# EAGLE design Meeblip V 2.04 Micro (EAGLE 5.11)
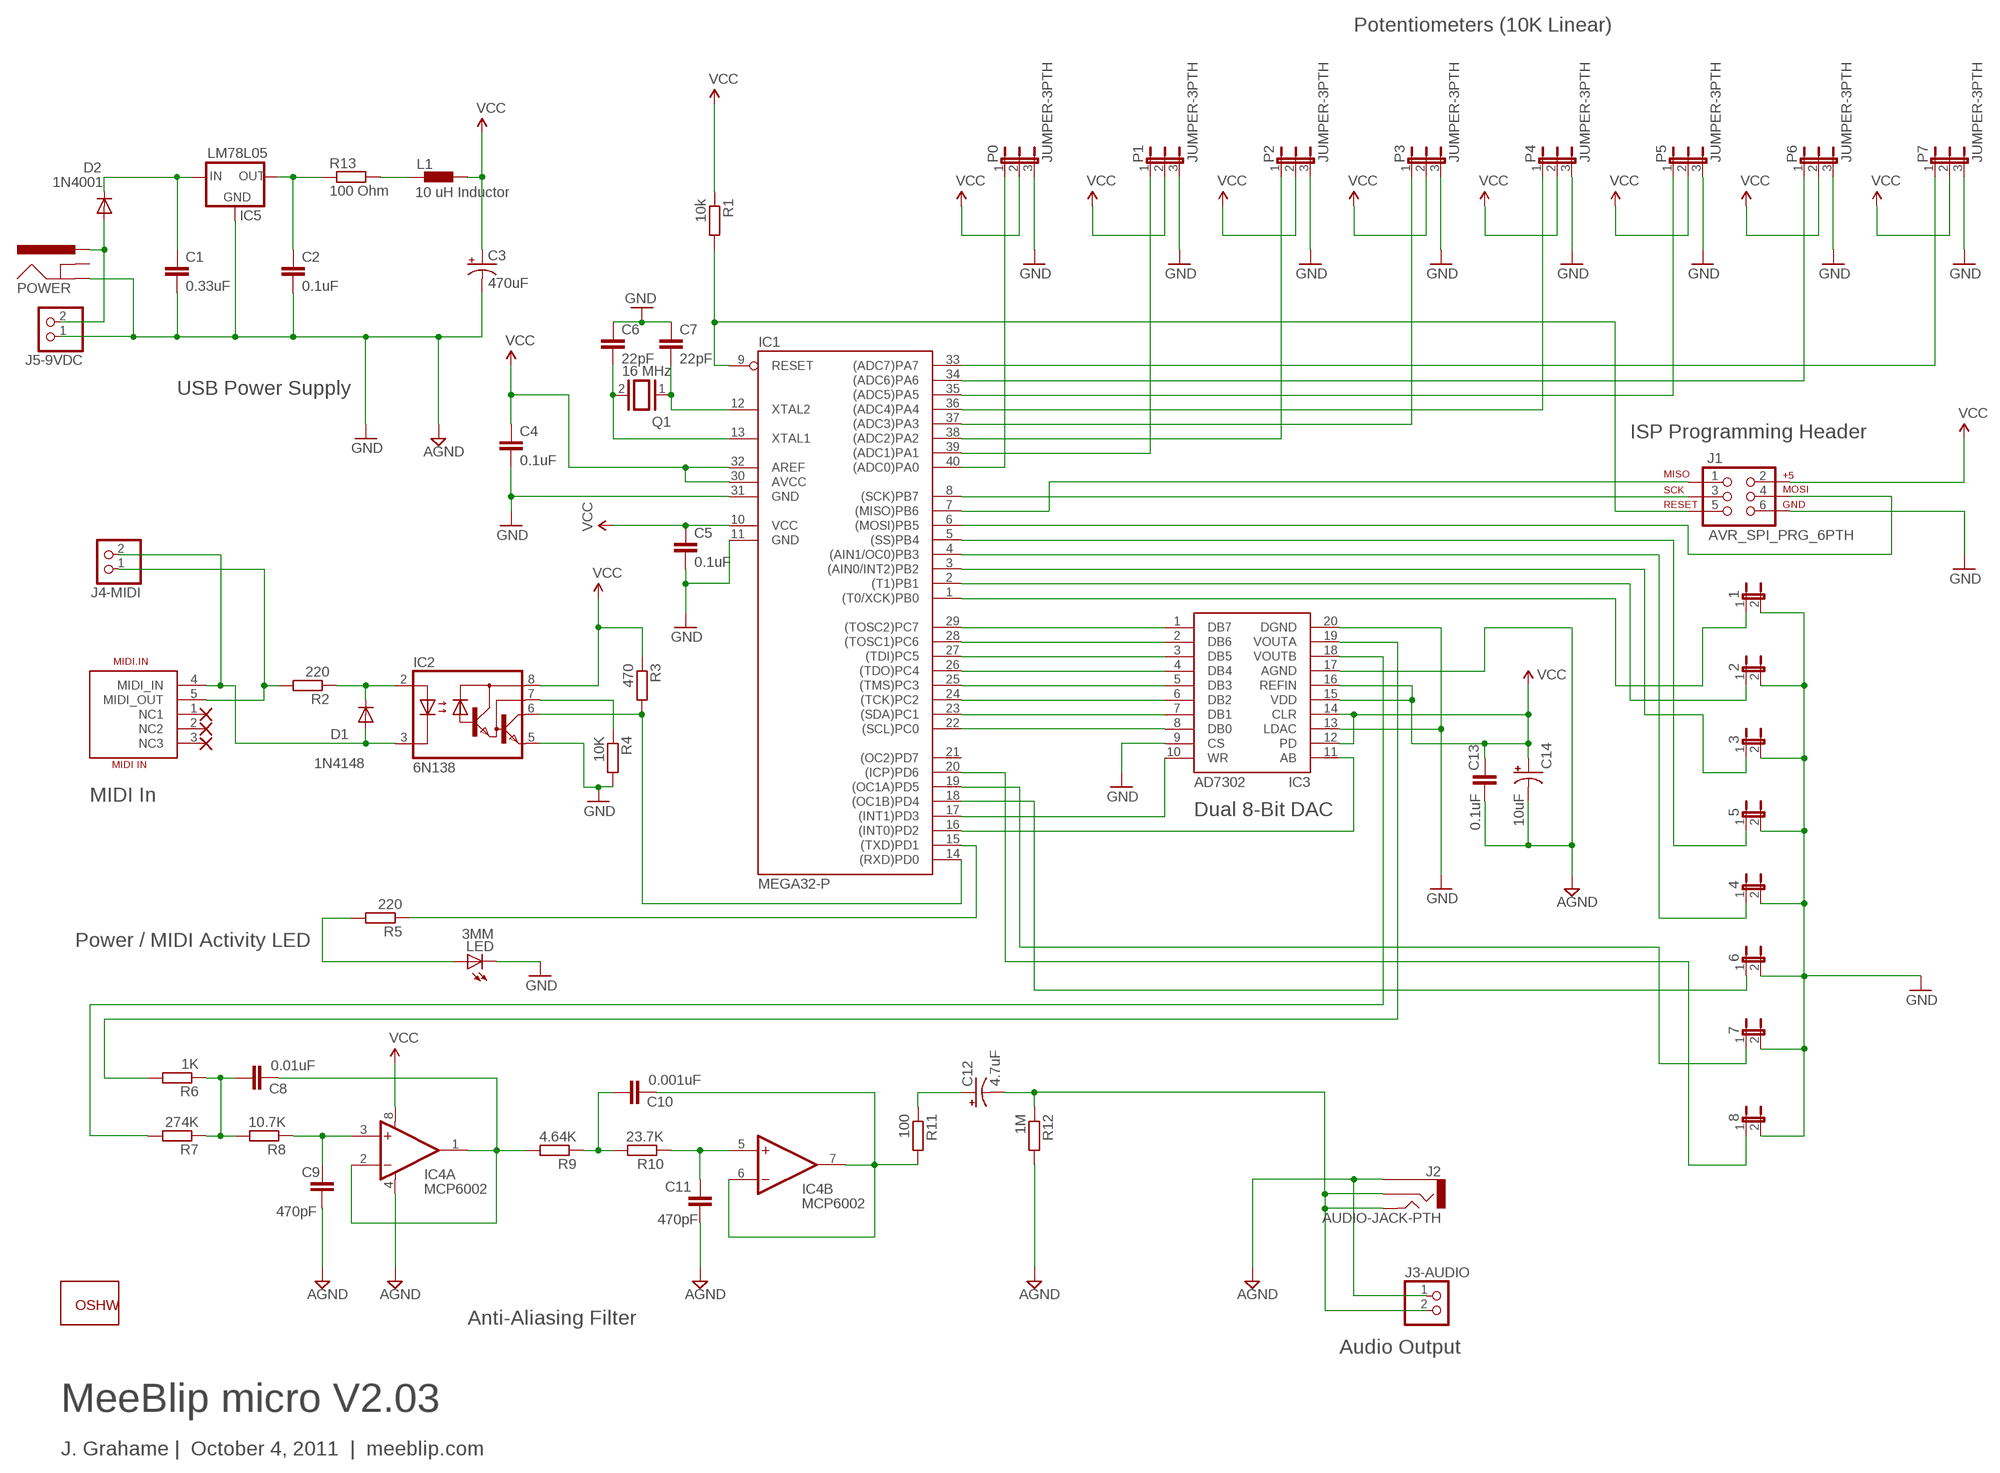
[diagram p0: schematic, sheet 1]

## Parts
1  JUMPER-2PTH  [1X02]
2  JUMPER-2PTH  [1X02]
3  JUMPER-2PTH  [1X02]
4  JUMPER-2PTH  [1X02]
5  JUMPER-2PTH  [1X02]
6  JUMPER-2PTH  [1X02]
7  JUMPER-2PTH  [1X02]
8  JUMPER-2PTH  [1X02]
C1  0.33uF  CAPPTH  [CAP-PTH-SMALL]
C2  0.1uF  CAPPTH  [CAP-PTH-SMALL]
C3  470uF  CAP_POLPTH2  [CPOL-RADIAL-10UF-25V]
C4  0.1uF  CAPPTH  [CAP-PTH-SMALL]
C5  0.1uF  CAPPTH  [CAP-PTH-SMALL]
C6  22pF  CAPPTH  [CAP-PTH-SMALL]
C7  22pF  CAPPTH  [CAP-PTH-SMALL]
C8  0.01uF  CAPPTH  [CAP-PTH-SMALL]
C9  470pF  CAPPTH  [CAP-PTH-SMALL]
C10  0.001uF  CAPPTH  [CAP-PTH-SMALL]
C11  470pF  CAPPTH  [CAP-PTH-SMALL]
C12  4.7uF  CAP_POLPTH2  [CPOL-RADIAL-10UF-25V]
C13  0.1uF  CAPPTH  [CAP-PTH-SMALL]
C14  10uF  CAP_POLPTH2  [CPOL-RADIAL-10UF-25V]
D1  1N4148  DIODE1N4148  [DIODE-1N4148]
D2  1N4001  DIODEPTH  [DIODE-1N4001]
GOLD_ORB_SM1  OSHWLOGO_GOLD_ORB_MED  [OSHW1]
IC1  MEGA32-P  [DIL40]
IC2  6N138  [DIL08]
IC3  AD7302  [DIL20]
IC4  MCP6002  [DIL08]
IC5  LM78L05  78LXX  [78LXX]
J1  AVR_SPI_PRG_6PTH  [2X3]
J2  AUDIO-JACK-PTH  [AUDIO-JACK]
J3-AUDIO  PINHD-1X2  [1X02]
J4-MIDI  PINHD-1X2  [1X02]
J5-9VDC  PINHD-1X2  [1X02]
L1  10 uH Inductor  BL0-10UH  [BL01RN1A]
LED  3MM  LED3MM  [LED3MM]
MIDI.IN  MIDI IN  MIDI_CONN_FEMALE_SUPPORT  [DIN_5_FEMALE_SUPPORT]
P0  JUMPER-3PTH  [1X03]
P1  JUMPER-3PTH  [1X03]
P2  JUMPER-3PTH  [1X03]
P3  JUMPER-3PTH  [1X03]
P4  JUMPER-3PTH  [1X03]
P5  JUMPER-3PTH  [1X03]
P6  JUMPER-3PTH  [1X03]
P7  JUMPER-3PTH  [1X03]
POWER  POWER_JACKPTH  [POWER_JACK_PTH]
Q1  16 MHz  XTAL/S  [QS]
R1  10k  R-EU_0207/10  [0207/10]
R2  220  R-EU_0207/10  [0207/10]
R3  470  R-EU_0207/10  [0207/10]
R4  10K  R-EU_0207/10  [0207/10]
R5  220  R-EU_0207/10  [0207/10]
R6  1K  R-EU_0207/10  [0207/10]
R7  274K  R-EU_0207/10  [0207/10]
R8  10.7K  R-EU_0207/10  [0207/10]
R9  4.64K  R-EU_0207/10  [0207/10]
R10  23.7K  R-EU_0207/10  [0207/10]
R11  100  R-EU_0207/10  [0207/10]
R12  1M  R-EU_0207/10  [0207/10]
R13  100 Ohm  R-EU_0207/10  [0207/10]

## Nets
AGND: C9.2 C11.2 C13.2 C14.2(-) IC3.17(AGND) IC4.4(A:V-) J2.1 J3-AUDIO.1 R12.2
GND: 1.2 2.2 3.2 4.2 5.2 6.2 7.2 8.2 C1.2 C2.2 C3.2(-) C4.2 C5.2 C6.1 C7.1 IC1.11(GND) IC1.31(GND) IC2.5(GND) IC3.9(CS) IC3.13(LDAC) IC3.20(DGND) IC5.GND J1.6 J5-9VDC.1 LED.K(C) P0.3 P1.3 P2.3 P3.3 P4.3 P5.3 P6.3 P7.3 POWER.GND R4.2 ; supply symbol labelled AGND
N$1: C7.2 IC1.12(XTAL2) Q1.1
N$2: C6.2 IC1.13(XTAL1) Q1.2
N$3: IC1.6((MOSI)PB5) J1.4
N$4: IC1.8((SCK)PB7) J1.3
N$5: IC1.7((MISO)PB6) J1.1
N$6: IC1.40((ADC0)PA0) P0.1
N$7: IC1.39((ADC1)PA1) P1.1
N$8: IC1.9(RESET) J1.5 R1.2
N$9: IC1.38((ADC2)PA2) P2.1
N$10: IC1.37((ADC3)PA3) P3.1
N$11: IC1.15((TXD)PD1) R5.1
N$12: IC1.36((ADC4)PA4) P4.1
N$13: LED.A R5.2
N$14: IC1.35((ADC5)PA5) P5.1
N$15: IC1.34((ADC6)PA6) P6.1
N$16: IC1.33((ADC7)PA7) P7.1
N$17: L1.1 R13.2
N$18: IC1.22((SCL)PC0) IC3.8(DB0)
N$19: IC3.19(VOUTA) R6.2
N$20: J4-MIDI.1 MIDI.IN.5(MIDI_OUT) R2.2
N$21: C12.1(+) R11.1
N$22: 4.1 IC1.4((AIN1/OC0)PB3)
N$23: C12.2(-) J2.2 J2.5 J3-AUDIO.2 R12.1
N$24: 6.1 IC1.18((OC1B)PD4)
N$25: D2.A J5-9VDC.2 POWER.PWR
N$26: 3.1 IC1.3((AIN0/INT2)PB2)
N$27: C1.1 D2.C IC5.IN
N$28: 7.1 IC1.19((OC1A)PD5)
N$29: 8.1 IC1.20((ICP)PD6)
N$35: IC1.23((SDA)PC1) IC3.7(DB1)
N$36: IC1.24((TCK)PC2) IC3.6(DB2)
N$37: IC1.25((TMS)PC3) IC3.5(DB3)
N$38: IC1.26((TDO)PC4) IC3.4(DB4)
N$39: IC1.27((TDI)PC5) IC3.3(DB5)
N$40: IC1.28((TOSC1)PC6) IC3.2(DB6)
N$41: IC1.29((TOSC2)PC7) IC3.1(DB7)
N$42: C2.1 IC5.OUT R13.1
N$43: IC1.17((INT1)PD3) IC3.10(WR)
N$45: D1.C IC2.2(A) R2.1
N$46: D1.A IC2.3(C) J4-MIDI.2 MIDI.IN.4(MIDI_IN)
N$47: IC1.14((RXD)PD0) IC2.6(VO) R3.2
N$48: IC1.16((INT0)PD2) IC3.11(AB)
N$69: C8.1 R6.1 R7.1 R8.2
N$70: IC3.18(VOUTB) R7.2
N$71: C9.1 IC4.3(A:+IN) R8.1
N$73: C10.1 R9.1 R10.2
N$74: C11.1 IC4.5(B:+IN) R10.1
N$75: C10.2 IC4.6(B:-IN) IC4.7(B:OUT) R11.2
N$77: C8.2 IC4.1(A:OUT) IC4.2(A:-IN) R9.2
N$96: IC2.7(VB) R4.1
S1: 1.1 IC1.1((T0/XCK)PB0)
S3: 2.1 IC1.2((T1)PB1)
S8: 5.1 IC1.5((SS)PB4)
VCC: C3.1(+) C4.1 C5.1 C13.1 C14.1(+) IC1.10(VCC) IC1.30(AVCC) IC1.32(AREF) IC2.8(VCC) IC3.12(PD) IC3.14(CLR) IC3.15(VDD) IC3.16(REFIN) IC4.8(A:V+) J1.2 L1.2 P0.2 P1.2 P2.2 P3.2 P4.2 P5.2 P6.2 P7.2 R1.1 R3.1
Unconnected: IC1.21((OC2)PD7) MIDI.IN.1(NC1) MIDI.IN.2(NC2) MIDI.IN.3(NC3) POWER.GNDBREAK

## Notes on the sheet
- Potentiometers (10K Linear)
- 10 uH Inductor
- USB Power Supply
- ISP Programming Header
- MIDI In
- Dual 8-Bit DAC
- Power / MIDI Activity LED
- Anti-Aliasing Filter
- Audio Output
- MeeBlip micro V2.03
- J. Grahame |  October 4, 2011  |  meeblip.com

## Library data of the parts
1-8 = SparkFun:JUMPER-2: Jumper Basic 0.1" spaced jumper. Use with breakaway headers.
C1 C2 C4-C11 C13 = meeblip:CAP: Capacitor Standard 0.1" leaded capacitor, based on SparkFun library.
C3 C12 C14 = meeblip:CAP_POL: Capacitor Polarized Standard PTH capacitor, from SparkFun.
D1 D2 = meeblip:DIODE: Diodes 1N4148 and 1N4001 power diodes.
GOLD_ORB_SM1 = NBitWonder:OSHWLOGO: These are Open-Source Hardware logos.
IC1 = meeblip:MEGA32-P: MICROCONTROLLER 32 Kbytes FLASH 2 Kbytes SRAM 1 Kbytes EEPROM USART 8-channel 10 bit ADC Source: www.atmel.com .. doc2503.pdf
IC2 = meeblip:6N138: MOTOROLA OPTO COUPLER
IC3 = meeblip:AD7302: AD7302
IC4 = meeblip:MCP6002: Dual Op Amp
IC5 = meeblip:78LXX: VOLTAGE REGULATOR Optional for use with 9 VDC power. Rated 100 mW.
J1 = meeblip:AVR_SPI_PRG_6: AVR ISP 6 Pin Smaller header for AVR programming. From SparkFun library.
J2 = meeblip:AUDIO-JACK: 3.5mm Audio Jack 3.5mm PCB mount audio jack. Sparkfun SKU: PRT-08032 (from SparkFun library)
J3-AUDIO J4-MIDI J5-9VDC = meeblip:PINHD-1X2: PIN HEADER
L1 = meeblip:BL0: Noise Suppression Products/EMI Suppression Filters, Lead EMIFIL(R) Inductor Type Source: http://www.murata.com .. BL01RN1_DS.pdf
LED = meeblip:LED: LED OSRAM: - CHIPLED LG R971, LG N971, LY N971, LG Q971, LY Q971, LO R971, LY R971 LH N974, LH R974 LS Q976, LO Q976, LY Q976 LO Q996 - Hyper CHIPLED LW Q18S LB Q993, LB Q99A, LB R99A - SideLED LS A670, LO A670, LY A670, LG A670, LP A670 LB A673, LV A673, LT A673, LW A673 LH A674 LY A675 LS A676, LA A676, LO A676, LY A676, LW A676 LS A679, LY A679, LG A679 - Hyper Micro SIDELED® LS Y876, LA Y876, LO Y876, LY Y876 LT Y87S - SmartLED LW L88C, LW L88S LB L89C, LB L89S, LG L890 LS L89K, LO L89K, LY L89K LS L896, LA L896, LO L896, LY L896 - TOPLED LS T670, LO T670, LY T670, LG T670, LP T670 LSG T670, LSP T670, LSY T670, LOP T670, LYG T670 LG T671, LOG T671, LSG T671 LB T673, LV T673, LT T673, LW T673 LH T674 LS T676, LA T676, LO T676, LY T676, LB T676, LH T676, LSB T676, LW T676 LB T67C, LV T67C, LT T67C, LS T67K, LO T67K, LY T67K, LW E67C LS E67B, LA E67B, LO E67B, LY E67B, LB E67C, LV E67C, LT E67C LW T67C LS T679, LY T679, LG T679 LS T770, LO T770, LY T770, LG T770, LP T770 LB T773, LV T773, LT T773, LW T773 LH T774 LS E675, LA E675, LY E675, LS T675 LS T776, LA T776, LO T776, LY T776, LB T776 LHGB T686 LT T68C, LB T68C - Hyper Mini TOPLED® LB M676 - Mini TOPLED Santana® LG M470 LS M47K, LO M47K, LY M47K Source: http://www.osram.convergy.de LUXEON: - LUMILED® LXK2-PW12-R00, LXK2-PW12-S00, LXK2-PW14-U00, LXK2-PW14-V00 LXK2-PM12-R00, LXK2-PM12-S00, LXK2-PM14-U00 LXK2-PE12-Q00, LXK2-PE12-R00, LXK2-PE12-S00, LXK2-PE14-T00, LXK2-PE14-U00 LXK2-PB12-K00, LXK2-PB12-L00, LXK2-PB12-M00, LXK2-PB14-N00, LXK2-PB14-P00, LXK2-PB14-Q00 LXK2-PR12-L00, LXK2-PR12-M00, LXK2-PR14-Q00, LXK2-PR14-R00 LXK2-PD12-Q00, LXK2-PD12-R00, LXK2-PD12-S00 LXK2-PH12-R00, LXK2-PH12-S00 LXK2-PL12-P00, LXK2-PL12-Q00, LXK2-PL12-R00 Source: www.luxeon.com KINGBRIGHT: KA-3528ASYC Source: www.kingbright.com
MIDI.IN = Reflex:MIDI_CONN_FEMALE_SUPPORT
P0 P1-P7 = SparkFun:JUMPER-3
POWER = meeblip:POWER_JACK: Power Jack 5.5mm barrel jack for optional 9 VDC power input.
Q1 = meeblip:XTAL/S: CRYSTAL Through-hole. Cheap and cheery.
R1-R13 = meeblip:R-EU_: RESISTOR, European symbol

## Board
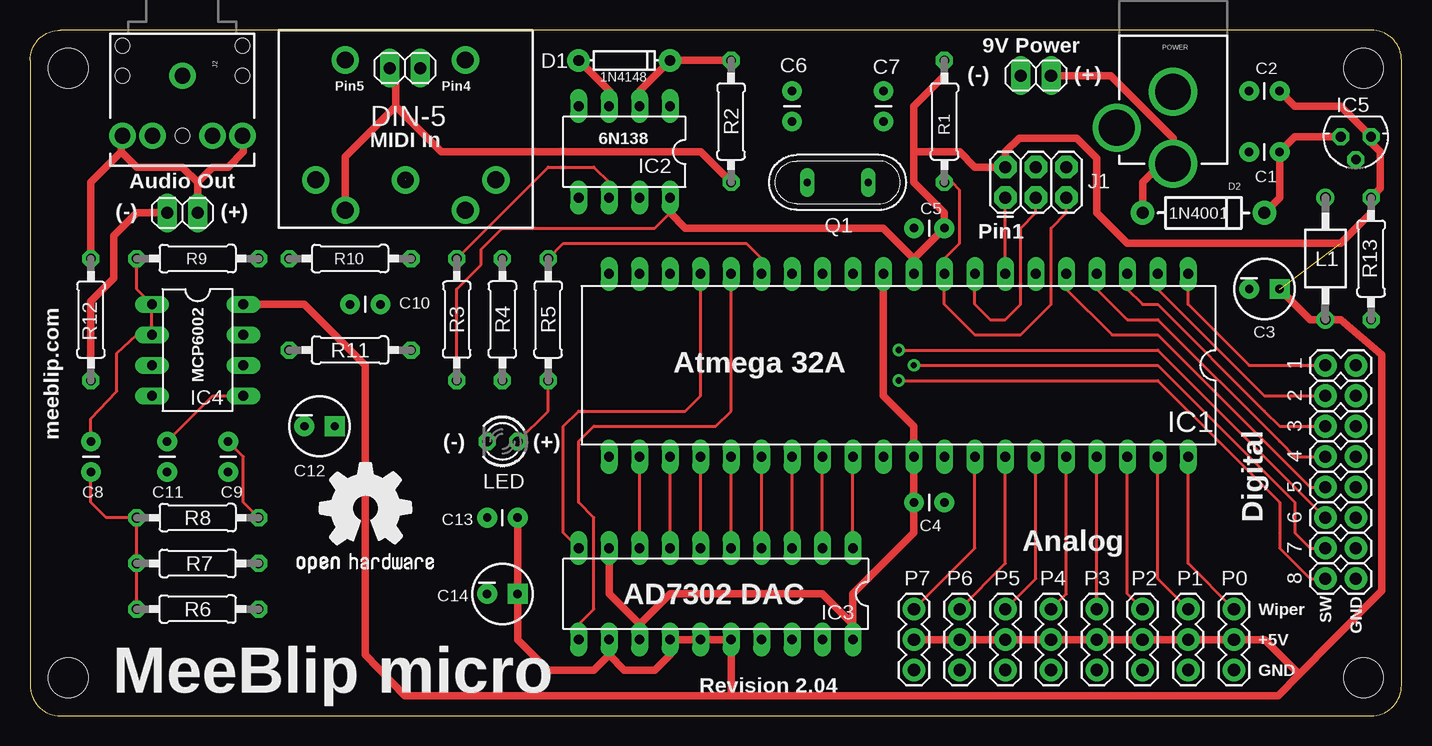
[diagram p1: board, top side]
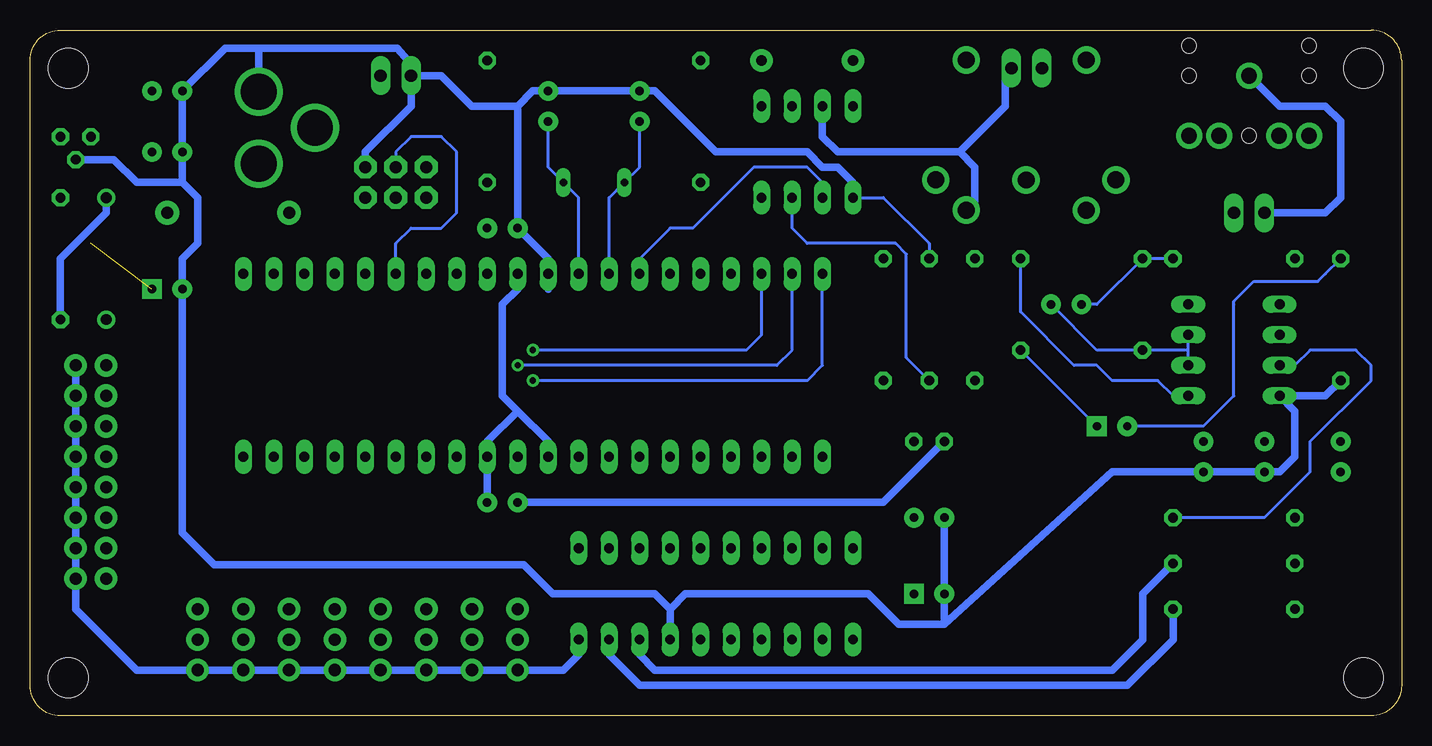
[diagram p2: board, bottom side, seen from below]

Size 114.3 x 57.15 mm. Coordinates in mm from the lower left corner, seen from the top.
Outline: 0,54.61 arc-90 2.54,57.15 111.76,57.15 arc-90 114.3,54.61 114.3,2.54 arc-90 111.76,0 2.54,0 arc-90 0,2.54 0,54.61
Copper layers (1*16): Top 0.035mm / dielectric 1.5mm / Bottom 0.035mm
Design rules "SparkFun": minimum track width 8mil, minimum drill 20mil, track to track 8mil, track to pad 8mil, pad to pad 8mil, via to via 8mil, smd to smd 8mil, copper to edge 10mil, drill to drill 8mil, minimum pad ring 12mil, minimum via ring 10mil, stop-mask expansion 4mil, vias tented up to drill 25mil, thermal gap 10mil

### Footprints (pad centres in the part's own frame; a part is rotated, then mirrored left to right if it is on the bottom)
1X02 = drill 1.016 pad 1.88 round: 1 0,0; 2 2.54,0
CAP-PTH-SMALL = drill 0.7 pad 1.651 round: 1 0,0; 2 2.54,0
CPOL-RADIAL-10UF-25V = drill 0.7 pad 1.651 square: 1 1.27,0 | drill 0.7 pad 1.651 round: 2 -1.27,0
DIODE-1N4148 = drill 0.9 pad 1.88 round: A -3.81,0; C 3.81,0
DIODE-1N4001 = drill 1 pad 1.981 round: A -5.08,0; C 5.08,0
DIL40 = drill 0.813 long: 1 -24.13,-7.62; 2 -21.59,-7.62; 3 -19.05,-7.62; 4 -16.51,-7.62; 5 -13.97,-7.62; 6 -11.43,-7.62; 7 -8.89,-7.62; 8 -6.35,-7.62; 9 -3.81,-7.62; 10 -1.27,-7.62; 11 1.27,-7.62; 12 3.81,-7.62; 13 6.35,-7.62; 14 8.89,-7.62; 15 11.43,-7.62; 16 13.97,-7.62; 17 16.51,-7.62; 18 19.05,-7.62; 19 21.59,-7.62; 20 24.13,-7.62; 21 24.13,7.62; 22 21.59,7.62; 23 19.05,7.62; 24 16.51,7.62; 25 13.97,7.62; 26 11.43,7.62; 27 8.89,7.62; 28 6.35,7.62; 29 3.81,7.62; 30 1.27,7.62; 31 -1.27,7.62; 32 -3.81,7.62; 33 -6.35,7.62; 34 -8.89,7.62; 35 -11.43,7.62; 36 -13.97,7.62; 37 -16.51,7.62; 38 -19.05,7.62; 39 -21.59,7.62; 40 -24.13,7.62
DIL08 = drill 0.813 long: 1 -3.81,-3.81; 2 -1.27,-3.81; 3 1.27,-3.81; 4 3.81,-3.81; 5 3.81,3.81; 6 1.27,3.81; 7 -1.27,3.81; 8 -3.81,3.81
DIL20 = drill 0.813 long: 1 -11.43,-3.81; 2 -8.89,-3.81; 3 -6.35,-3.81; 4 -3.81,-3.81; 5 -1.27,-3.81; 6 1.27,-3.81; 7 3.81,-3.81; 8 6.35,-3.81; 9 8.89,-3.81; 10 11.43,-3.81; 11 11.43,3.81; 12 8.89,3.81; 13 6.35,3.81; 14 3.81,3.81; 15 1.27,3.81; 16 -1.27,3.81; 17 -3.81,3.81; 18 -6.35,3.81; 19 -8.89,3.81; 20 -11.43,3.81
78LXX = drill 0.813 octagon: GND 0,1.905; IN 1.27,0; OUT -1.27,0
2X3 = drill 1.016 pad 1.88 octagon: 1 0,0; 2 0,2.54; 3 2.54,0; 4 2.54,2.54; 5 5.08,0; 6 5.08,2.54
AUDIO-JACK = drill 1.3 pad 2.184 round: 1 0,0; 2 5,5; 3 5,2.5; 4 5,-2.5; 5 5,-5 | hole 1.2: 0,5; -2.5,5; -2.5,-5; 0,-5; 5,0
1X02' = drill 1.016 long: 1 -1.27,0; 2 1.27,0
STAND-OFF = hole 3.302: 0,0
BL01RN1A = drill 0.9 pad 1.5 round: 1 -5.08,0; 2 5.08,0
LED3MM = drill 0.813 octagon: A -1.27,0; K 1.27,0
DIN_5_FEMALE_SUPPORT = drill 1.4 pad 2.286 round: 1 0.46,3.61; 2 -7.07,3.6; 3 7.94,3.6; 4 -4.53,6.12; 5 5.47,6.13; 6 -4.53,-6.382; 7 5.478,-6.382
1X03 = drill 1.016 pad 1.88 round: 1 0,0; 2 2.54,0; 3 5.08,0
POWER_JACK_PTH = drill 2.997 round: GND 0,7.7; GNDBREAK 4.7,10.7; PWR 0,13.7
QS = drill 0.61 long: 1 -2.54,0; 2 2.54,0
0207/10 = drill 0.813 octagon: 1 -5.08,0; 2 5.08,0

### Placement (x,y rotation side)
1  107.95,29.21 0 top
2  107.95,26.67 0 top
3  107.95,24.13 0 top
4  107.95,21.59 0 top
5  107.95,19.05 0 top
6  107.95,16.51 0 top
7  107.95,13.97 0 top
8  107.95,11.43 0 top
C1  104.14,46.99 180 top
C2  104.14,52.07 180 top
C3  102.87,35.56 0 top
C4  76.2,17.78 180 top
C5  76.2,40.64 180 top
C6  63.5,52.07 270 top
C7  71.12,52.07 270 top
C8  5.08,20.32 90 top
C9  16.51,22.86 270 top
C10  26.67,34.29 0 top
C11  11.43,22.86 270 top
C12  24.13,24.13 0 top
C13  40.64,16.51 180 top
C14  39.37,10.16 0 top
D1  49.53,54.61 0 top
D2  97.79,41.91 0 top
GOLD_ORB_SM1  21.59,10.16 0 top
IC1  72.39,29.21 180 top
IC2  49.53,46.99 180 top
IC3  57.15,10.16 180 top
IC4  13.97,30.48 270 top
IC5  110.49,48.26 180 top
J1  81.28,43.18 0 top
J2  12.7,53.34 270 top
J3-AUDIO  [1X02']  12.7,41.91 0 top
J4-MIDI  [1X02']  31.24,53.98 0 top
J5-9VDC  [1X02']  83.82,53.34 0 top
JP4  STAND-OFF  [STAND-OFF]  3.17,53.98 0 top
JP19  STAND-OFF  [STAND-OFF]  3.17,3.17 0 top
JP20  STAND-OFF  [STAND-OFF]  111.12,53.98 0 top
JP21  STAND-OFF  [STAND-OFF]  111.12,3.17 0 top
L1  107.95,38.1 270 top
LED  39.37,22.86 180 top
MIDI.IN  31.75,48.26 180 top
P0  100.33,8.89 270 top
P1  96.52,8.89 270 top
P2  92.71,8.89 270 top
P3  88.9,8.89 270 top
P4  85.09,8.89 270 top
P5  81.28,8.89 270 top
P6  77.47,8.89 270 top
P7  73.66,8.89 270 top
POWER  95.25,59.69 180 top
Q1  67.31,44.45 180 top
R1  76.2,49.53 270 top
R2  58.42,49.53 270 top
R3  35.56,33.02 90 top
R4  39.37,33.02 90 top
R5  43.18,33.02 270 top
R6  13.97,8.89 0 top
R7  13.97,12.7 0 top
R8  13.97,16.51 180 top
R9  13.97,38.1 180 top
R10  26.67,38.1 180 top
R11  26.67,30.48 180 top
R12  5.08,33.02 270 top
R13  111.76,38.1 270 top

### Tracks (layer width: path | path; a pad name or v marks a point on that pad's centre or on a via)
AGND
  Top 0.61: R12.2 5.08,34.54 6.99,36.45 6.99,40.01 8.89,41.91 J3-AUDIO.1
  Bottom 0.61: C9.2 C11.2 10.16,20.32 8.89,21.59 8.89,25.4 IC4.4 6.35,26.67 R12.2 | J3-AUDIO.1 6.35,41.91 5.08,43.18 5.08,49.53 6.35,50.8 10.16,50.8 J2.1 | C9.2 17.78,20.32 | 60.96,8.89 62.23,10.16 70.74,10.16 73.15,12.57 98.93,12.57 101.6,15.24 101.6,35.56 | 60.96,8.89 59.69,10.16 44.45,10.16 41.91,7.62 38.1,7.62 | 38.1,7.62 24.13,20.32 C9.2 | 60.96,8.89 IC3.17 | C13.2 C14.2 38.1,7.62
GND
  Top 0.61: IC1.11 71.12,26.67 73.66,24.13 IC1.31 C4.2 73.66,15.24 68.58,10.16 68.58,7.62 | IC3.9 48.26,10.16 50.8,7.62 | IC3.13 50.8,7.62 | 50.8,7.62 53.34,10.16 66.04,10.16 68.58,7.62 | 68.58,7.62 IC3.20
  Bottom 0.254: IC2.5 43.18,43.18 39.37,39.37 R4.2
  Bottom 0.61: 71.12,35.56 IC1.11 71.12,38.1 C5.2 73.66,50.8 | IC2.5 45.72,44.45 46.99,45.72 48.26,45.72 49.53,46.99 57.15,46.99 62.23,52.07 C6.1 C7.1 72.39,52.07 73.66,50.8 | C2.2 C1.2 101.6,44.45 | 101.6,44.45 100.33,43.18 100.33,39.37 101.6,38.1 C3.2 101.6,34.29 | IC5.GND 107.31,46.35 105.41,44.45 101.6,44.45 | J5-9VDC.1 82.55,54.61 82.8,54.61 83.69,55.63 95.25,55.63 | C2.2 101.52,51.99 | IC3.20 68.58,5.08 69.85,3.81 P7.3 P6.3 P5.3 P4.3 P3.3 P2.3 P1.3 P0.3 105.41,3.81 110.49,8.89 8.2 7.2 6.2 5.2 4.2 3.2 2.2 1.2 | 95.25,55.63 98.04,55.63 C2.2 | 95.25,55.63 POWER.GND | J5-9VDC.1 80.01,53.34 77.47,50.8 73.66,50.8 | J5-9VDC.1 82.55,50.8 86.36,46.99 J1.6 | LED.K 43.18,17.78 C4.2
N$1
  Bottom 0.254: IC1.12 68.58,43.18 Q1.1 71.12,45.72 C7.2
N$2
  Bottom 0.254: IC1.13 66.04,43.18 Q1.2 63.5,45.72 C6.2
N$3
  Bottom 0.254: IC1.6 83.82,39.37 82.55,40.64 80.01,40.64 78.74,41.91 78.74,46.99 80.01,48.26 82.55,48.26 83.82,46.99 J1.4
N$4
  Top 0.254: IC1.8 78.74,34.29 80.01,33.02 81.28,33.02 82.55,34.29 82.55,40.64 83.82,41.91 J1.3
N$5
  Top 0.254: IC1.7 J1.1
N$6
  Top 0.254: IC1.40 96.52,12.7 P0.1
N$7
  Top 0.254: IC1.39 93.98,11.43 P1.1
N$8
  Top 0.254: IC1.9 76.2,38.1 | 76.2,38.1 77.47,39.37 77.47,43.81 76.83,44.45 R1.2 | IC1.9 76.2,38.1 | J1.5 86.36,41.91 85.09,40.64 85.09,34.29 82.55,31.75 78.74,31.75 76.2,34.29 IC1.9
N$9
  Top 0.254: IC1.38 91.44,10.16 P2.1
N$10
  Top 0.254: IC1.37 88.9,11.43 P3.1
N$11
  Top 0.254: R5.1 44.45,39.37 59.69,39.37 60.96,38.1 IC1.15
N$12
  Top 0.254: IC1.36 86.36,10.16 P4.1
N$13
  Top 0.254: LED.A 43.18,25.4 R5.2
N$14
  Top 0.254: IC1.35 83.82,11.43 P5.1
N$15
  Top 0.254: IC1.34 81.28,12.7 P6.1
N$16
  Top 0.254: IC1.33 78.74,13.97 P7.1
N$17
  Bottom 0.61: L1.1 107.95,41.91 111.76,38.1 R13.2
N$18
  Top 0.254: IC3.8 IC1.22
N$19
  Bottom 0.61: IC3.19 66.04,5.08 63.5,2.54 22.86,2.54 19.05,6.35 R6.2
N$20
  Top 0.61: R2.2 55.88,46.99 34.29,46.99 30.48,50.8 | 30.48,50.8 30.48,53.47 J4-MIDI.1 | MIDI.IN.5 26.28,46.6 30.48,50.8
N$21
  Bottom 0.254: C12.1 29.21,27.94 R11.1
N$22
  Top 0.254: IC1.4 88.9,35.56 91.44,33.02 93.98,33.02 104.14,22.86 105.41,21.59 4.1
N$23
  Top 0.61: 13.97,44.45 J3-AUDIO.2 | 13.97,44.45 12.7,45.72 8.89,45.72 7.62,46.99 | R12.1 5.08,44.45 7.62,46.99 | 13.97,44.45 15.24,45.72 16.51,45.72 17.78,46.99 17.78,48.26 J2.2 | 7.62,46.99 7.62,48.26 J2.5
  Bottom 0.254: C12.2 16.51,24.13 13.97,26.67 13.97,34.29 13.97,34.54 12.32,36.2 6.99,36.2 6.35,36.83 R12.1
N$24  (via drill 0.51)
  Top 0.254: 6.1 93.98,30.48 v72.39,30.48
  Bottom 0.254: v72.39,30.48 54.61,30.48 53.34,31.75 IC1.18
N$25
  Top 0.61: D2.A 92.71,44.45 94.25,45.99 POWER.PWR 95.25,48.13 90.04,53.34 J5-9VDC.2
N$26
  Top 0.254: IC1.3 91.44,35.56 92.71,34.29 93.98,34.29 102.87,25.4 104.14,24.13 3.1
N$27
  Top 0.61: D2.C 104.14,43.18 C1.1 105.41,48.26 IC5.IN
N$28  (via drill 0.51)
  Top 0.254: v73.66,29.21 93.98,29.21 100.33,22.86 105.41,17.78 105.41,16.51 105.41,15.24 106.68,13.97 7.1
  Bottom 0.254: IC1.19 50.8,30.48 52.07,29.21 v73.66,29.21
N$29  (via drill 0.51)
  Top 0.254: v72.39,27.94 93.98,27.94 99.06,22.86 104.14,17.78 104.14,15.24 104.14,13.97 106.68,11.43 8.1
  Bottom 0.254: IC1.20 48.26,29.21 49.53,27.94 v72.39,27.94
N$35
  Top 0.254: IC3.7 IC1.23
N$36
  Top 0.254: IC3.6 IC1.24
N$37
  Top 0.254: IC3.5 IC1.25
N$38
  Top 0.254: IC3.4 IC1.26
N$39
  Top 0.254: IC3.3 IC1.27
N$40
  Top 0.254: IC3.2 IC1.28
N$41
  Top 0.254: IC3.1 IC1.29
N$42
  Top 0.61: C2.1 105.41,50.8 109.22,50.8 IC5.OUT 111.76,47.75 112.52,46.99 112.52,43.94 R13.1
N$43
  Top 0.254: 55.88,35.56 IC1.17 55.88,26.67 54.61,25.4 45.72,25.4 44.45,24.13 44.45,15.24 IC3.10
N$45
  Top 0.61: IC2.2 50.8,52.07 D1.C R2.1
N$46
  Top 0.61: D1.A 48.26,52.07 IC2.3
  Bottom 0.61: IC2.3 48.26,48.26 46.99,46.99 38.1,46.99 36.83,46.99 | 36.83,46.99 33.02,50.8 33.02,53.34 32.51,53.85 J4-MIDI.2 | 36.83,46.99 35.56,45.72 35.56,42.86 MIDI.IN.4
N$47
  Top 0.254: R3.2 43.18,45.72 46.99,45.72 48.26,44.45 | 48.26,44.45 IC2.6 48.26,44.45
  Bottom 0.254: IC1.14 63.5,38.1 60.96,40.64 59.69,40.64 59.05,40.64 53.98,45.72 49.53,45.72 48.26,44.45 IC2.6
N$48
  Top 0.254: IC3.11 45.72,7.62 46.99,8.89 46.99,16.51 45.72,17.78 45.72,22.86 46.99,24.13 57.15,24.13 58.42,25.4 58.42,29.21 IC1.16
N$69
  Top 0.254: R6.1 R7.1 R8.2 6.35,16.51 5.08,17.78 C8.1
N$70
  Bottom 0.61: IC3.18 63.5,5.08 62.23,3.81 24.13,3.81 21.59,6.35 21.59,10.16 R7.2
N$71
  Top 0.254: R8.1 17.78,17.78 17.78,21.59 C9.1
  Bottom 0.254: R8.1 12.7,16.51 11.43,16.51 7.62,20.32 7.62,22.86 2.54,27.94 2.54,29.21 3.81,30.48 7.62,30.48 8.89,29.21 IC4.3
N$73
  Bottom 0.254: R9.1 R10.2 25.4,34.29 C10.1
N$74
  Top 0.254: C11.1 15.24,26.67 IC4.5
  Bottom 0.254: IC4.5 19.05,26.67 20.32,27.94 24.13,27.94 25.4,29.21 27.3,29.21 31.75,33.66 R10.1
N$75
  Bottom 0.254: IC4.6 17.78,30.48 | 17.78,30.48 IC4.7 | 17.78,30.48 R11.2 | R11.2 22.86,30.48 | C10.2 29.17,34.25 25.4,30.48 R11.2
N$77
  Top 0.254: R9.2 8.89,35.56 IC4.1 IC4.2 8.89,31.75 7.24,30.23 7.24,27.05 5.08,24.77 C8.2
N$96
  Bottom 0.254: R4.1 41.27,29.84 41.27,38.48 42.16,39.37 49.53,39.37 50.8,40.64 IC2.7
S1
  Top 0.254: IC1.1 96.52,34.29 101.6,29.21 1.1
S3
  Top 0.254: IC1.2 93.98,35.56 102.87,26.67 2.1
S8
  Top 0.254: IC1.5 86.36,35.56 90.17,31.75 93.98,31.75 102.87,22.86 106.68,19.05 5.1
VCC  (1 unrouted)
  Top 0.254: R3.1 35.56,35.56 37.59,37.59 37.59,38.86 39.37,40.64 52.07,40.64 53.34,41.91
  Top 0.61: P7.2 P6.2 P5.2 P4.2 P3.2 P2.2 P1.2 P0.2 102.88,6.35 105.77,3.46 | 73.66,38.1 IC1.10 | IC2.8 53.34,41.91 54.61,40.64 71.12,40.64 73.66,38.1 | 73.66,38.1 C5.1 76.2,41.91 73.66,44.45 73.66,46.99 | C3.1 106.68,33.02 L1.2 109.22,33.02 112.65,30.1 112.65,10.41 108.58,6.35 105.77,3.46 | 48.26,5.08 49.53,3.81 52.07,3.81 53.34,5.08 IC3.14 IC3.15 IC3.16 58.42,1.65 | 48.26,5.08 IC3.12 | 48.26,5.08 46.99,3.81 43.18,3.81 40.64,6.35 C14.1 C13.1 | IC4.8 22.86,34.29 27.94,29.21 27.94,5.08 31.24,1.65 58.42,1.65 | 73.66,46.99 73.66,50.8 76.2,53.34 R1.1 | 58.42,1.65 104.01,1.65 105.77,3.46 | 73.66,46.99 77.47,46.99 78.74,45.72 J1.2 81.28,46.99 82.42,48.13 87.25,48.13 88.9,46.48 88.9,41.91 91.44,39.37 109.22,39.37 111.76,41.91 111.76,43.18
  Bottom 0.61: 73.66,25.4 76.2,22.86 IC1.32 C4.1 | IC1.30 71.12,22.86 73.66,25.4 | IC1.10 73.66,35.56 74.93,34.29 74.93,26.67 73.66,25.4

### Text on the board
tNames: 9V Power | (-) | (+) | Pin5 | Pin4 | 6N138 | MIDI In | Audio Out | (-) | (+) | Pin1 | meeblip.com | Atmega 32A | MCP6002 | (-) | (+) | Digital | Analog | AD7302 DAC | Wiper | SW | GND | +5V | GND | MeeBlip micro | Revision 2.04